# Altium schematic sheet ENET.SchDoc: My title
size A3; Organization: University of California; Address1: 475 Portola Plaza; Address2: Los Angeles, CA 90095; Revision: R01; SheetNumber: 1; SheetTotal: 1
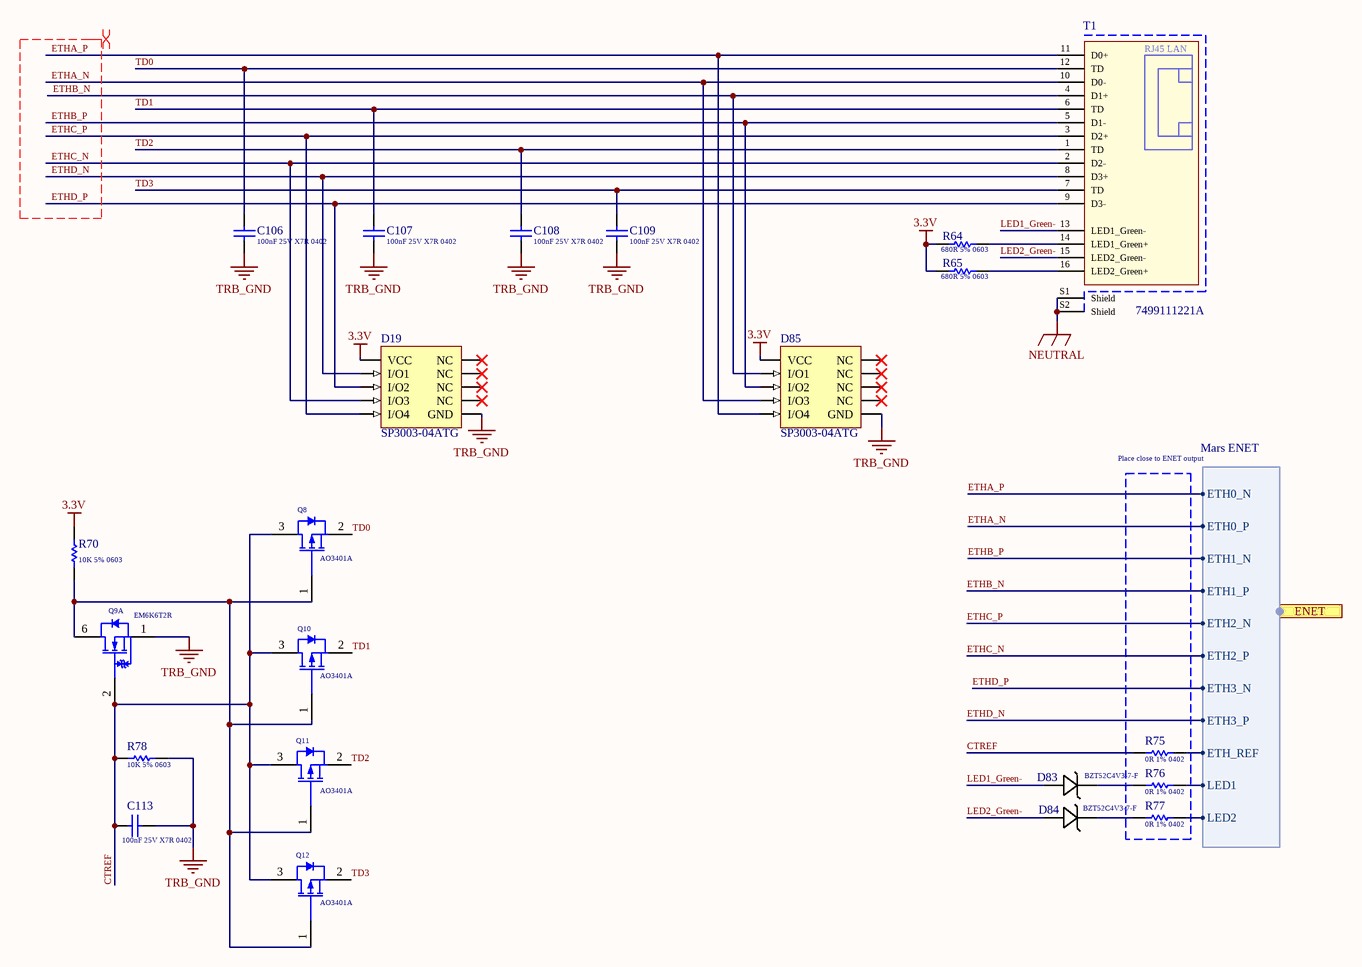
[diagram p0: ENET.SchDoc]

## Parts
C106  Capacitance: 100nF 25V X7R 0402  [Cap_Taiyo_Yuden_TMK105B7104KV-FR_100nF]  (hidden comment: Cap_Taiyo_Yuden_TMK105B7104KV-FR_100nF)
C107  Capacitance: 100nF 25V X7R 0402  [Cap_Taiyo_Yuden_TMK105B7104KV-FR_100nF]  (hidden comment: Cap_Taiyo_Yuden_TMK105B7104KV-FR_100nF)
C108  Capacitance: 100nF 25V X7R 0402  [Cap_Taiyo_Yuden_TMK105B7104KV-FR_100nF]  (hidden comment: Cap_Taiyo_Yuden_TMK105B7104KV-FR_100nF)
C109  Capacitance: 100nF 25V X7R 0402  [Cap_Taiyo_Yuden_TMK105B7104KV-FR_100nF]  (hidden comment: Cap_Taiyo_Yuden_TMK105B7104KV-FR_100nF)
C113  Capacitance: 100nF 25V X7R 0402  [Cap_Taiyo_Yuden_TMK105B7104KV-FR_100nF]  (hidden comment: Cap_Taiyo_Yuden_TMK105B7104KV-FR_100nF)
D19  Series: SP3003-04ATG  [Diode_SP3003-04ATG_LVDS_ESD]  (hidden comment: Diode_SP3003-04ATG_LVDS_ESD)
D83  BZT52C4V3-7-F  [SOD123]
D84  BZT52C4V3-7-F  [SOD123]
D85  Series: SP3003-04ATG  [Diode_SP3003-04ATG_LVDS_ESD]  (hidden comment: Diode_SP3003-04ATG_LVDS_ESD)
Q8  Series: AO3401A  [Mos_Alpha&Omega_AO3401A_4A]  (hidden comment: Mos_Alpha&Omega_AO3401A_4A)
Q9  Series: EM6K6T2R  [Mos_ROHM_EM6K6T2R_N_300mA]  (hidden comment: Mos_ROHM_EM6K6T2R_N_300mA)  (part A of 2)
Q10  Series: AO3401A  [Mos_Alpha&Omega_AO3401A_4A]  (hidden comment: Mos_Alpha&Omega_AO3401A_4A)
Q11  Series: AO3401A  [Mos_Alpha&Omega_AO3401A_4A]  (hidden comment: Mos_Alpha&Omega_AO3401A_4A)
Q12  Series: AO3401A  [Mos_Alpha&Omega_AO3401A_4A]  (hidden comment: Mos_Alpha&Omega_AO3401A_4A)
R64  680R 5% 0603  [RESC0603(1608)_L]
R65  680R 5% 0603  [RESC0603(1608)_L]
R70  10K 5% 0603  [RESC0603(1608)_L]
R75  Resistance: 0R 1% 0402  [Res_Vishay_CRCW04020000Z0EDC_0_Ohm]  (hidden comment: Res_Vishay_CRCW04020000Z0EDC_0_Ohm)
R76  Resistance: 0R 1% 0402  [Res_Vishay_CRCW04020000Z0EDC_0_Ohm]  (hidden comment: Res_Vishay_CRCW04020000Z0EDC_0_Ohm)
R77  Resistance: 0R 1% 0402  [Res_Vishay_CRCW04020000Z0EDC_0_Ohm]  (hidden comment: Res_Vishay_CRCW04020000Z0EDC_0_Ohm)
R78  10K 5% 0603  [RESC0603(1608)_L]
T1  7499111221A  [7499111221A]

## Ports
ENET (harness Mars ENET)

## Harnesses
Mars ENET: ETH0_P, ETH0_N, ETH1_P, ETH1_N, ETH2_P, ETH2_N, ETH3_P, ETH3_N, ETH_REF, LED1, LED2

## Nets
3.3V: D19.3(VCC) D85.3(VCC) R64.1 R65.1 R70.2
NEUTRAL: T1.S1(Shield) T1.S2(Shield)
TRB_GND: C106.1 C107.1 C108.1 C109.1 C113.1 D19.8(GND) D85.8(GND) Q9.1(S) R78.1
CTREF: C113.2 Q8.3(D) Q9.2(G) Q10.3(D) Q11.3(D) Q12.3(D) R75.1 R78.2
ETHA_N: D85.4(I/O3) T1.10(D0-) ; port ENET.ETH0_P
ETHA_P: D85.5(I/O4) T1.11(D0+) ; port ENET.ETH0_N
ETHB_N: D85.1(I/O1) T1.4(D1+) ; port ENET.ETH1_P
ETHB_P: D85.2(I/O2) T1.5(D1-) ; port ENET.ETH1_N
ETHC_N: D19.4(I/O3) T1.2(D2-) ; port ENET.ETH2_P
ETHC_P: D19.5(I/O4) T1.3(D2+) ; port ENET.ETH2_N
ETHD_N: D19.1(I/O1) T1.8(D3+) ; port ENET.ETH3_P
ETHD_P: D19.2(I/O2) T1.9(D3-) ; port ENET.ETH3_N
LED1_Green-: D83.2 T1.13(LED1_Green-)
LED2_Green-: D84.2 T1.15(LED2_Green-)
TD0: C106.2 Q8.2(S) T1.12(TD)
TD1: C107.2 Q10.2(S) T1.6(TD)
TD2: C108.2 Q11.2(S) T1.1(TD)
TD3: C109.2 Q12.2(S) T1.7(TD)
NetD83_1: D83.1 R76.1
NetD84_1: D84.1 R77.1
NetQ8_1: Q8.1(G) Q9.6(D) Q10.1(G) Q11.1(G) Q12.1(G) R70.1
NetR64_2: R64.2 T1.14(LED1_Green+)
NetR65_2: R65.2 T1.16(LED2_Green+)
NetR75_2: R75.2 ; port ENET.ETH_REF
NetR76_2: R76.2 ; port ENET.LED1
NetR77_2: R77.2 ; port ENET.LED2

Not connected (* = marked no-connect by the designer): D19 6(NC)* 7(NC)* 9(NC)* 10(NC)*; D85 6(NC)* 7(NC)* 9(NC)* 10(NC)*

## Layout directives
differential pair: ETHA_N, ETHA_P, ETHB_N, ETHB_P, ETHC_N, ETHC_P, ETHD_N, ETHD_P

## Notes on the sheet
- Place close to ENET output
- 475 Portola Plaza
- GAPS TOF
- igarcia91@g.ucla.edu
- Los Angeles, CA
- 310-825-0344
- Size:
- Date:
- Letter
- Number:
- Time:
- Sheet
- Revision:
- of
- andrew.peck@cern.ch
- spq@ucla.edu
- File:
- (in symbol 7499111221A) RJ45 LAN

## Library data of the parts
C106-C109 C113 = Cap_Taiyo_Yuden_TMK105B7104KV-FR_100nF: CAP CER 100nF 25V X7R 0402; Supplier 1: Mouser; Supplier Part Number 1: 963-TMK105B7104KV-FR
D19 D85 = Diode_SP3003-04ATG_LVDS_ESD: ESD Suppressors / TVS Diodes 4 Ch 8kV 0.65pF SPA; Supplier 1: Mouser; Supplier Part Number 1: 576-SP3003-04ATG
D83 D84 = BZT52C4V3-7-F: Zener Diodes 500mW 4.3V Zener AEC-Q101 Qualified; Vendor: Diodes Inc; Built_By: EMA_UL_Team; Type: DEV; C: Copyright (C) 2015 Accelerated Designs. All rights reserved; Manufacturer_Part_Number: BZT52C4V3-7-F; RefDes: RefDes; Supplier 1: Mouser; Supplier Part Number 1: 621-BZT52C4V3-F; Series: BZT52C4V3-7-F
Q8 Q10-Q12 = Mos_Alpha&Omega_AO3401A_4A: P-Channel 30V 4A (Ta) 1.4W (Ta) Surface Mount SOT-23-3L; Supplier 1: Digi-key; Supplier Part Number 1: 785-1001-1-ND
Q9 = Mos_ROHM_EM6K6T2R_N_300mA: MOSFET Small Signal Dual N-CH 20V .3A .15W; Supplier Part Number 1: 755-EM6K6T2R; Supplier 1: Mouser
R64 R65 = CMP-1012-00070-1: 680R 0.1W 5% 0603 (1608 Metric)  SMD; Case-EIA: 0603; Value: 680.00 Ohm; Case-Metric: 1608; Tolerance: 5 %; Technology: SMT; Power: 0.1 W
R70 R78 = CMP-1012-00098-1: 10K 0.1W 5% 0603 (1608 Metric)  SMD; Case-EIA: 0603; Value: 10000.00 Ohm; Case-Metric: 1608; Technology: SMT; Tolerance: 5 %; Power: 0.1 W
R75-R77 = Res_Vishay_CRCW04020000Z0EDC_0_Ohm: 0R 0.062W 1% 0402 (1005 Metric)  SMD; Supplier 1: Mouser; Supplier Part Number 1: 71-CRCW04020000Z0EDC
T1 = 7499111221A: WE-RJ45 LAN Transformer, 10/100/1000 Base-T, THT, Port 1x1, Tab Up; PoE: non-PoE; LED (Left-Right): green-green; USB: No; ComponentLink1Description: Manufacturer; ComponentLink1URL: http://www.we-online.de; ComponentLink2Description: Datasheet; ComponentLink2URL: http://katalog.we-online.de/pbs/datasheet/7499111221A.pdf; Part Number: 7499111221A; Published Date: Dec. 2017; Publisher: Wurth Elektronik; Tab Position: Up; Port Number: 1x1; Data Rate: 10/100/1000 Base-T; Operating Temperature: 0 to +70 degC; Mounting Technology: THT; Supplier Part Number 1: 710-7499111221A; Supplier 1: Mouser